# Altium schematic sheet SCH For IN12の世界线.SchDoc
size A3
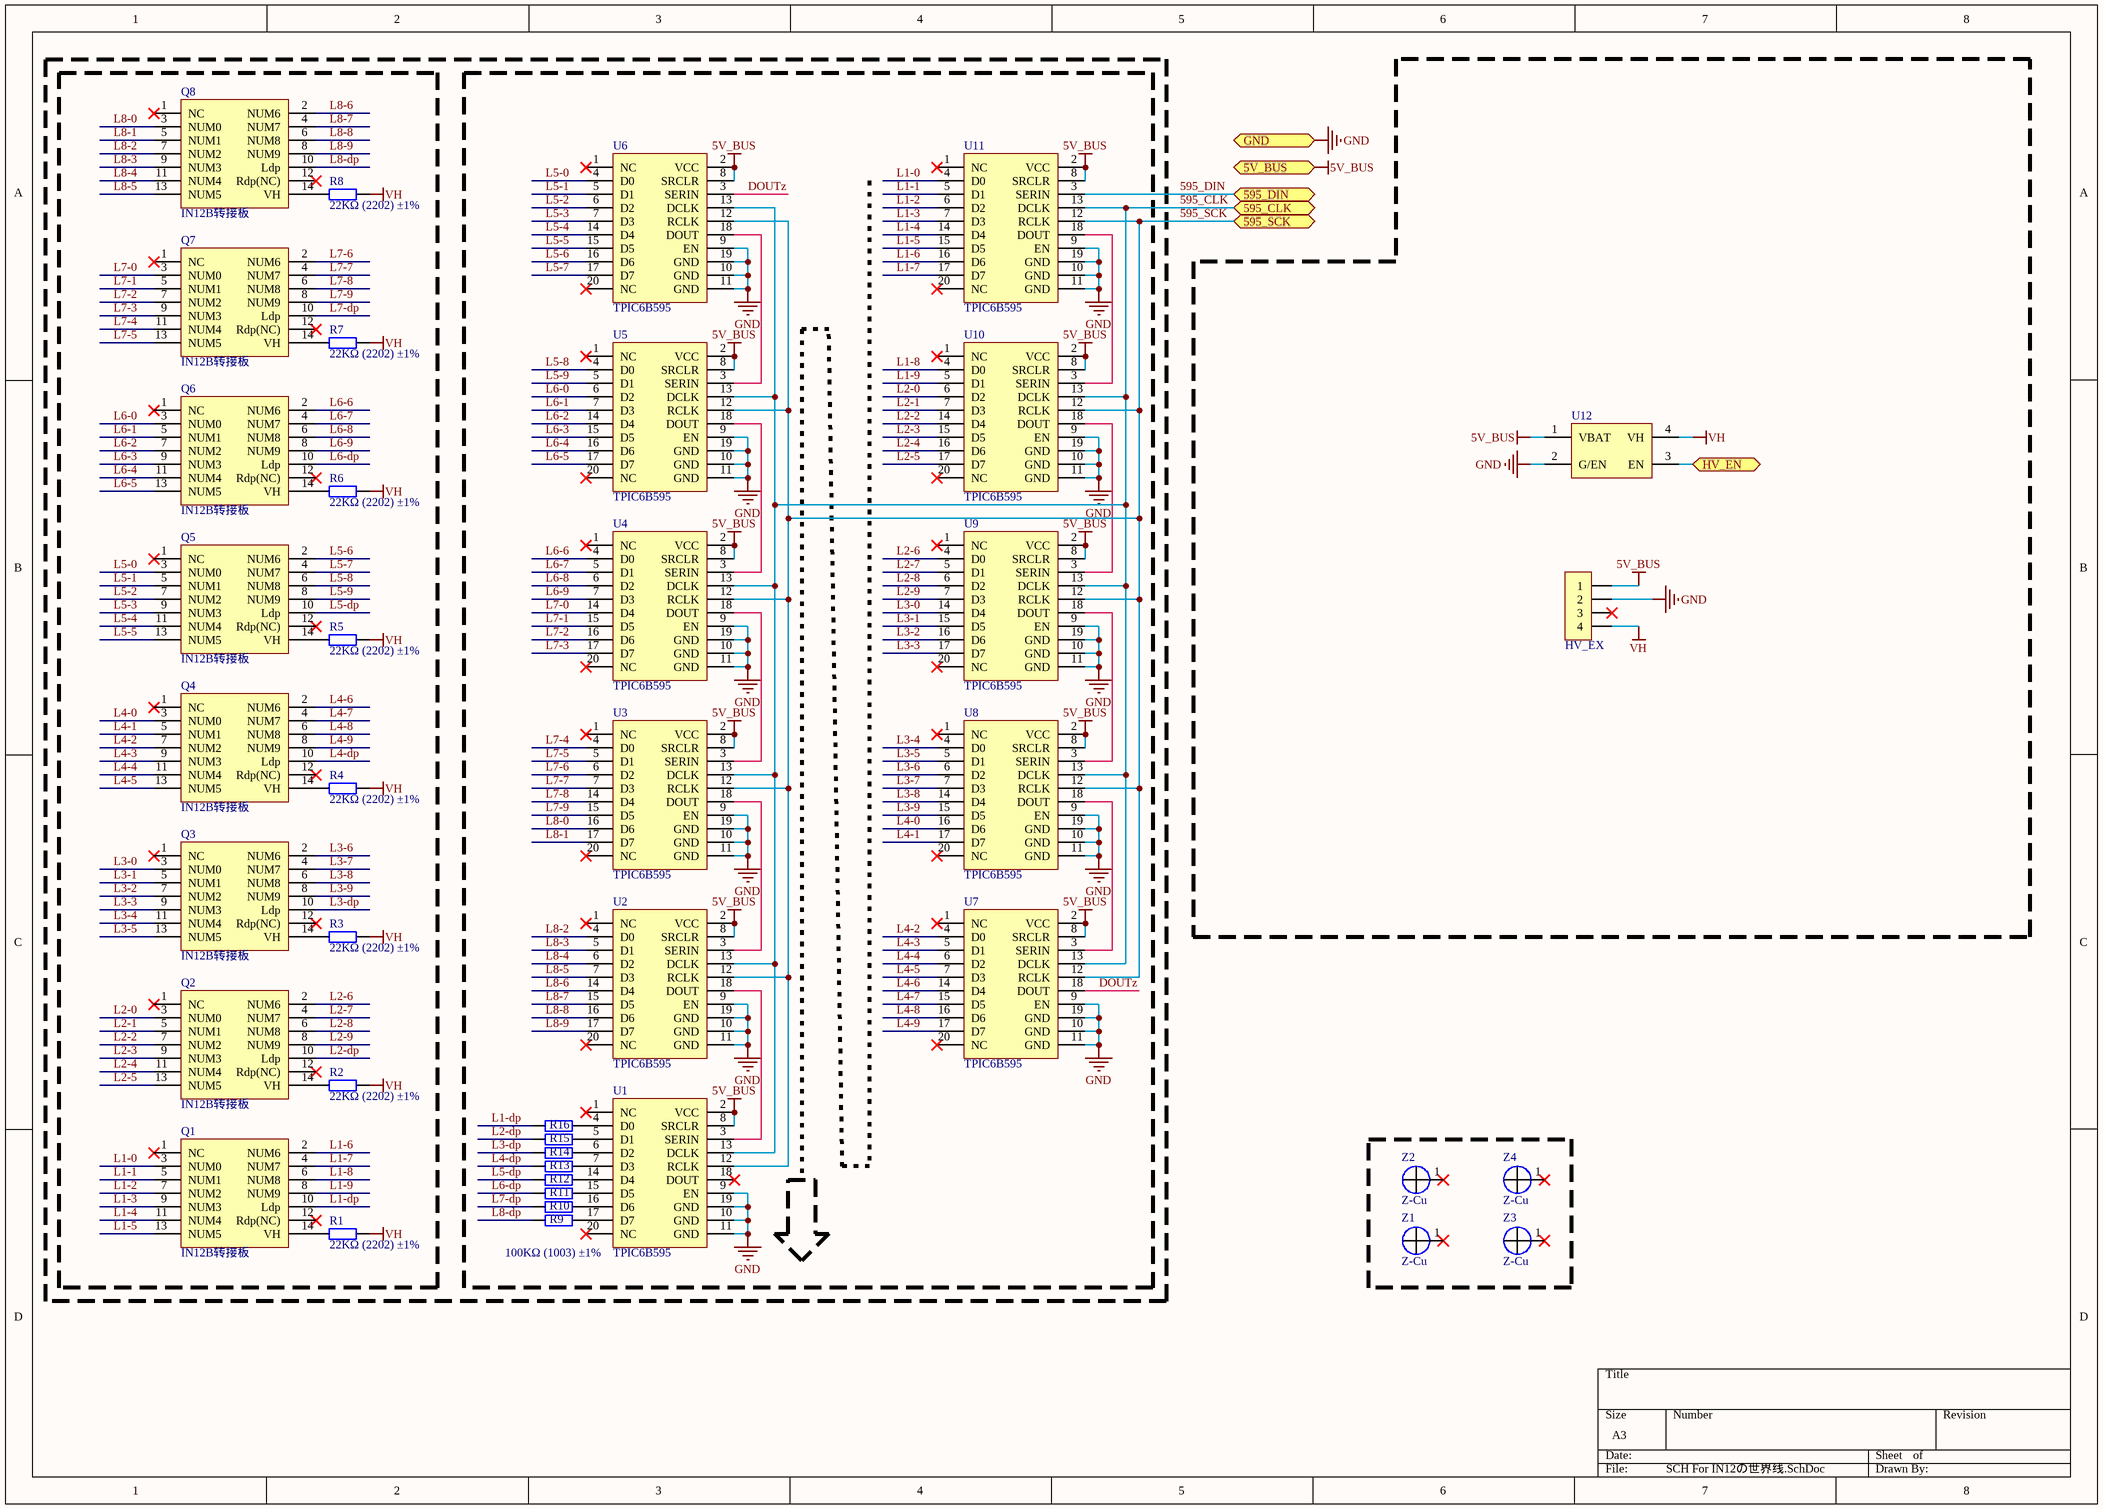
[diagram p0: SCH For IN12の世界线.SchDoc]

## Parts
HV_EX  HDR-1X4  [HDR2.54-WS-4P]  (value not drawn)
Q1  IN12B转接板  [NIXIE IN12 Trans]
Q2  IN12B转接板  [NIXIE IN12 Trans]
Q3  IN12B转接板  [NIXIE IN12 Trans]
Q4  IN12B转接板  [NIXIE IN12 Trans]
Q5  IN12B转接板  [NIXIE IN12 Trans]
Q6  IN12B转接板  [NIXIE IN12 Trans]
Q7  IN12B转接板  [NIXIE IN12 Trans]
Q8  IN12B转接板  [NIXIE IN12 Trans]
R1  22KΩ (2202) ±1%  [LC-0805_R]
R2  22KΩ (2202) ±1%  [LC-0805_R]
R3  22KΩ (2202) ±1%  [LC-0805_R]
R4  22KΩ (2202) ±1%  [LC-0805_R]
R5  22KΩ (2202) ±1%  [LC-0805_R]
R6  22KΩ (2202) ±1%  [LC-0805_R]
R7  22KΩ (2202) ±1%  [LC-0805_R]
R8  22KΩ (2202) ±1%  [LC-0805_R]
R9  100KΩ (1003) ±1%  [LC-0603_R]  (value not drawn)
R10  100KΩ (1003) ±1%  [LC-0603_R]  (value not drawn)
R11  100KΩ (1003) ±1%  [LC-0603_R]  (value not drawn)
R12  100KΩ (1003) ±1%  [LC-0603_R]  (value not drawn)
R13  100KΩ (1003) ±1%  [LC-0603_R]  (value not drawn)
R14  100KΩ (1003) ±1%  [LC-0603_R]  (value not drawn)
R15  100KΩ (1003) ±1%  [LC-0603_R]  (value not drawn)
R16  100KΩ (1003) ±1%  [LC-0603_R]
U1  TPIC6B595  [SOIC_20W]
U2  TPIC6B595  [SOIC_20W]
U3  TPIC6B595  [SOIC_20W]
U4  TPIC6B595  [SOIC_20W]
U5  TPIC6B595  [SOIC_20W]
U6  TPIC6B595  [SOIC_20W]
U7  TPIC6B595  [SOIC_20W]
U8  TPIC6B595  [SOIC_20W]
U9  TPIC6B595  [SOIC_20W]
U10  TPIC6B595  [SOIC_20W]
U11  TPIC6B595  [SOIC_20W]
U12  DCDC  [VH-DuDu]  (value not drawn)
Z1  Z-Cu  [M3x5_L]
Z2  Z-Cu  [M3x5_L]
Z3  Z-Cu  [M3x5_L]
Z4  Z-Cu  [M3x5_L]

## Ports
5V_BUS, 595_CLK, 595_DIN, 595_SCK, GND, HV_EN

## Nets
5V_BUS: HV_EX.1 U1.2(VCC) U1.8(SRCLR) U2.2(VCC) U2.8(SRCLR) U3.2(VCC) U3.8(SRCLR) U4.2(VCC) U4.8(SRCLR) U5.2(VCC) U5.8(SRCLR) U6.2(VCC) U6.8(SRCLR) U7.2(VCC) U7.8(SRCLR) U8.2(VCC) U8.8(SRCLR) U9.2(VCC) U9.8(SRCLR) U10.2(VCC) U10.8(SRCLR) U11.2(VCC) U11.8(SRCLR) U12.1(VBAT) ; port 5V_BUS
GND: HV_EX.2 U1.9(EN) U1.10(GND) U1.11(GND) U1.19(GND) U2.9(EN) U2.10(GND) U2.11(GND) U2.19(GND) U3.9(EN) U3.10(GND) U3.11(GND) U3.19(GND) U4.9(EN) U4.10(GND) U4.11(GND) U4.19(GND) U5.9(EN) U5.10(GND) U5.11(GND) U5.19(GND) U6.9(EN) U6.10(GND) U6.11(GND) U6.19(GND) U7.9(EN) U7.10(GND) U7.11(GND) U7.19(GND) U8.9(EN) U8.10(GND) U8.11(GND) U8.19(GND) U9.9(EN) U9.10(GND) U9.11(GND) U9.19(GND) U10.9(EN) U10.10(GND) U10.11(GND) U10.19(GND) U11.9(EN) U11.10(GND) U11.11(GND) U11.19(GND) U12.2(G/EN) ; port GND
VH: HV_EX.4 R1.2 R2.2 R3.2 R4.2 R5.2 R6.2 R7.2 R8.2 U12.4(VH)
595_CLK: U1.13(DCLK) U2.13(DCLK) U3.13(DCLK) U4.13(DCLK) U5.13(DCLK) U6.13(DCLK) U7.13(DCLK) U8.13(DCLK) U9.13(DCLK) U10.13(DCLK) U11.13(DCLK) ; port 595_CLK
595_DIN: U11.3(SERIN) ; port 595_DIN
595_SCK: U1.12(RCLK) U2.12(RCLK) U3.12(RCLK) U4.12(RCLK) U5.12(RCLK) U6.12(RCLK) U7.12(RCLK) U8.12(RCLK) U9.12(RCLK) U10.12(RCLK) U11.12(RCLK) ; port 595_SCK
DOUTz: U6.3(SERIN) U7.18(DOUT)
HV_EN: U12.3(EN) ; port HV_EN
L1-0: Q1.3(NUM0) U11.4(D0)
L1-1: Q1.5(NUM1) U11.5(D1)
L1-2: Q1.7(NUM2) U11.6(D2)
L1-3: Q1.9(NUM3) U11.7(D3)
L1-4: Q1.11(NUM4) U11.14(D4)
L1-5: Q1.13(NUM5) U11.15(D5)
L1-6: Q1.2(NUM6) U11.16(D6)
L1-7: Q1.4(NUM7) U11.17(D7)
L1-8: Q1.6(NUM8) U10.4(D0)
L1-9: Q1.8(NUM9) U10.5(D1)
L1-dp: Q1.10(Ldp) R16.1
L2-0: Q2.3(NUM0) U10.6(D2)
L2-1: Q2.5(NUM1) U10.7(D3)
L2-2: Q2.7(NUM2) U10.14(D4)
L2-3: Q2.9(NUM3) U10.15(D5)
L2-4: Q2.11(NUM4) U10.16(D6)
L2-5: Q2.13(NUM5) U10.17(D7)
L2-6: Q2.2(NUM6) U9.4(D0)
L2-7: Q2.4(NUM7) U9.5(D1)
L2-8: Q2.6(NUM8) U9.6(D2)
L2-9: Q2.8(NUM9) U9.7(D3)
L2-dp: Q2.10(Ldp) R15.1
L3-0: Q3.3(NUM0) U9.14(D4)
L3-1: Q3.5(NUM1) U9.15(D5)
L3-2: Q3.7(NUM2) U9.16(D6)
L3-3: Q3.9(NUM3) U9.17(D7)
L3-4: Q3.11(NUM4) U8.4(D0)
L3-5: Q3.13(NUM5) U8.5(D1)
L3-6: Q3.2(NUM6) U8.6(D2)
L3-7: Q3.4(NUM7) U8.7(D3)
L3-8: Q3.6(NUM8) U8.14(D4)
L3-9: Q3.8(NUM9) U8.15(D5)
L3-dp: Q3.10(Ldp) R14.1
L4-0: Q4.3(NUM0) U8.16(D6)
L4-1: Q4.5(NUM1) U8.17(D7)
L4-2: Q4.7(NUM2) U7.4(D0)
L4-3: Q4.9(NUM3) U7.5(D1)
L4-4: Q4.11(NUM4) U7.6(D2)
L4-5: Q4.13(NUM5) U7.7(D3)
L4-6: Q4.2(NUM6) U7.14(D4)
L4-7: Q4.4(NUM7) U7.15(D5)
L4-8: Q4.6(NUM8) U7.16(D6)
L4-9: Q4.8(NUM9) U7.17(D7)
L4-dp: Q4.10(Ldp) R13.1
L5-0: Q5.3(NUM0) U6.4(D0)
L5-1: Q5.5(NUM1) U6.5(D1)
L5-2: Q5.7(NUM2) U6.6(D2)
L5-3: Q5.9(NUM3) U6.7(D3)
L5-4: Q5.11(NUM4) U6.14(D4)
L5-5: Q5.13(NUM5) U6.15(D5)
L5-6: Q5.2(NUM6) U6.16(D6)
L5-7: Q5.4(NUM7) U6.17(D7)
L5-8: Q5.6(NUM8) U5.4(D0)
L5-9: Q5.8(NUM9) U5.5(D1)
L5-dp: Q5.10(Ldp) R12.1
L6-0: Q6.3(NUM0) U5.6(D2)
L6-1: Q6.5(NUM1) U5.7(D3)
L6-2: Q6.7(NUM2) U5.14(D4)
L6-3: Q6.9(NUM3) U5.15(D5)
L6-4: Q6.11(NUM4) U5.16(D6)
L6-5: Q6.13(NUM5) U5.17(D7)
L6-6: Q6.2(NUM6) U4.4(D0)
L6-7: Q6.4(NUM7) U4.5(D1)
L6-8: Q6.6(NUM8) U4.6(D2)
L6-9: Q6.8(NUM9) U4.7(D3)
L6-dp: Q6.10(Ldp) R11.1
L7-0: Q7.3(NUM0) U4.14(D4)
L7-1: Q7.5(NUM1) U4.15(D5)
L7-2: Q7.7(NUM2) U4.16(D6)
L7-3: Q7.9(NUM3) U4.17(D7)
L7-4: Q7.11(NUM4) U3.4(D0)
L7-5: Q7.13(NUM5) U3.5(D1)
L7-6: Q7.2(NUM6) U3.6(D2)
L7-7: Q7.4(NUM7) U3.7(D3)
L7-8: Q7.6(NUM8) U3.14(D4)
L7-9: Q7.8(NUM9) U3.15(D5)
L7-dp: Q7.10(Ldp) R10.1
L8-0: Q8.3(NUM0) U3.16(D6)
L8-1: Q8.5(NUM1) U3.17(D7)
L8-2: Q8.7(NUM2) U2.4(D0)
L8-3: Q8.9(NUM3) U2.5(D1)
L8-4: Q8.11(NUM4) U2.6(D2)
L8-5: Q8.13(NUM5) U2.7(D3)
L8-6: Q8.2(NUM6) U2.14(D4)
L8-7: Q8.4(NUM7) U2.15(D5)
L8-8: Q8.6(NUM8) U2.16(D6)
L8-9: Q8.8(NUM9) U2.17(D7)
L8-dp: Q8.10(Ldp) R9.1
NetQ1_14: Q1.14(VH) R1.1
NetQ2_14: Q2.14(VH) R2.1
NetQ3_14: Q3.14(VH) R3.1
NetQ4_14: Q4.14(VH) R4.1
NetQ5_14: Q5.14(VH) R5.1
NetQ6_14: Q6.14(VH) R6.1
NetQ7_14: Q7.14(VH) R7.1
NetQ8_14: Q8.14(VH) R8.1
NetR9_2: R9.2 U1.17(D7)
NetR10_2: R10.2 U1.16(D6)
NetR11_2: R11.2 U1.15(D5)
NetR12_2: R12.2 U1.14(D4)
NetR13_2: R13.2 U1.7(D3)
NetR14_2: R14.2 U1.6(D2)
NetR15_2: R15.2 U1.5(D1)
NetR16_2: R16.2 U1.4(D0)
NetU1_3: U1.3(SERIN) U2.18(DOUT)
NetU2_3: U2.3(SERIN) U3.18(DOUT)
NetU3_3: U3.3(SERIN) U4.18(DOUT)
NetU4_3: U4.3(SERIN) U5.18(DOUT)
NetU5_3: U5.3(SERIN) U6.18(DOUT)
NetU7_3: U7.3(SERIN) U8.18(DOUT)
NetU8_3: U8.3(SERIN) U9.18(DOUT)
NetU9_3: U9.3(SERIN) U10.18(DOUT)
NetU10_3: U10.3(SERIN) U11.18(DOUT)

Not connected (* = marked no-connect by the designer): HV_EX 3*; Q1 1(NC)* 12(Rdp(NC))*; Q2 1(NC)* 12(Rdp(NC))*; Q3 1(NC)* 12(Rdp(NC))*; Q4 1(NC)* 12(Rdp(NC))*; Q5 1(NC)* 12(Rdp(NC))*; Q6 1(NC)* 12(Rdp(NC))*; Q7 1(NC)* 12(Rdp(NC))*; Q8 1(NC)* 12(Rdp(NC))*; U1 1(NC)* 18(DOUT)* 20(NC)*; U2 1(NC)* 20(NC)*; U3 1(NC)* 20(NC)*; U4 1(NC)* 20(NC)*; U5 1(NC)* 20(NC)*; U6 1(NC)* 20(NC)*; U7 1(NC)* 20(NC)*; U8 1(NC)* 20(NC)*; U9 1(NC)* 20(NC)*; U10 1(NC)* 20(NC)*; U11 1(NC)* 20(NC)*; Z1 1*; Z2 1*; Z3 1*; Z4 1*

## Library data of the parts
HV_EX = Header 4: 4P接插件; 版权归属: 源创客; BOM名称: 4P接插件; 学习资源: www.ooocke.com
Q1-Q8 = NIXIE IN-12B转接板: CCCP IN12B转接板; Design By：: simonire@qq.com
R1-R8 = 0805 22KΩ (2202) 1%: 贴片电阻; ComponentLink1Description: 供应商链接; ComponentLink1URL: http://www.szlcsc.com/product/details_18248.html; Package: 0805; Supplier: LC; SuppliersPartNumber: C17560
R9-R16 = 0603 100KΩ (1003) 1%: 贴片电阻; ComponentLink1Description: 供应商链接; ComponentLink1URL: http://www.szlcsc.com/product/details_26546.html; Package: 0603; Supplier: LC; SuppliersPartNumber: C25803
U1-U11 = TPIC6B595: 8bits译码驱动器
U12 = 5V->VH: 5V升压驱动; Design By：: simonire@qq.com
Z1-Z4 = Z-Cu: Cu